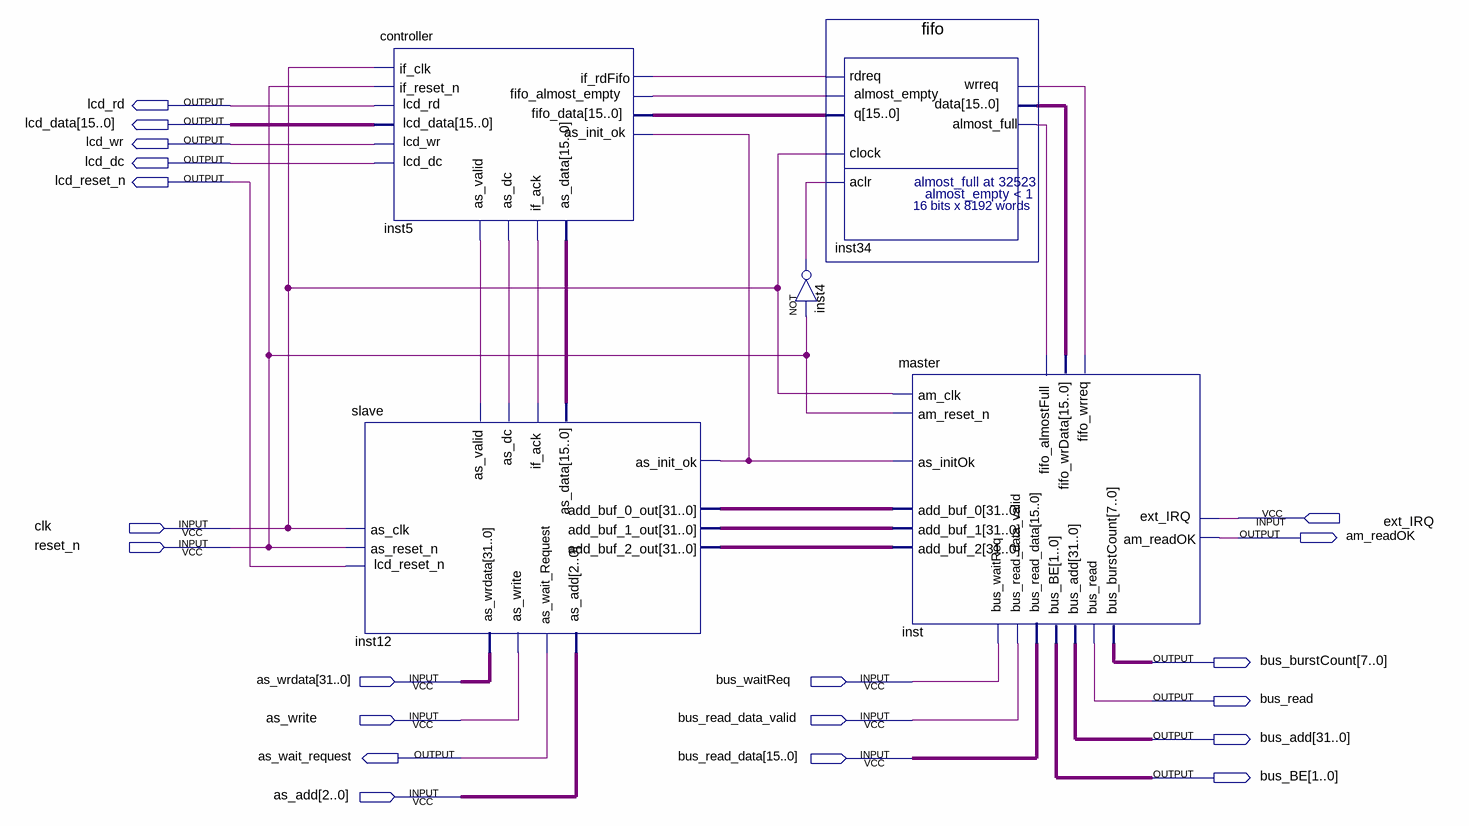
[diagram p0: schematic sheet]
// Quartus schematic LCD.bdf as structural Verilog: 5 symbols, 20 pins
module LCD (
  input  ext_IRQ,
  input  clk,
  input  reset_n,
  input  [31:0] as_wrdata,
  input  bus_waitReq,
  input  as_write,
  input  bus_read_data_valid,
  input  [15:0] bus_read_data,
  input  [2:0] as_add,
  output lcd_rd,
  output [15:0] lcd_data,
  output lcd_wr,
  output lcd_dc,
  output lcd_reset_n,
  output am_readOK,
  output [7:0] bus_burstCount,
  output bus_read,
  output [31:0] bus_add,
  output as_wait_request,
  output [1:0] bus_BE
);

  wire inst4_out, inst5_if_ack, inst5_if_rdfifo, inst12_as_dc, inst12_as_init_ok, inst12_as_valid,
       inst34_almost_empty, inst34_almost_full, inst_fifo_wrreq;
  wire [15:0] inst12_as_data, inst34_q, inst_fifo_wrdata;
  wire [31:0] inst12_add_buf_0_out, inst12_add_buf_1_out, inst12_add_buf_2_out;

  slave inst12 (
    .as_clk(clk), .as_reset_n(reset_n), .as_wrdata(as_wrdata), .as_add(as_add), .as_write(as_write),
    .if_ack(inst5_if_ack), .as_wait_Request(as_wait_request), .as_init_ok(inst12_as_init_ok),
    .add_buf_0_out(inst12_add_buf_0_out), .add_buf_1_out(inst12_add_buf_1_out),
    .add_buf_2_out(inst12_add_buf_2_out), .as_valid(inst12_as_valid), .as_data(inst12_as_data),
    .as_dc(inst12_as_dc), .lcd_reset_n(lcd_reset_n));
  controller inst5 (
    .if_clk(clk), .if_reset_n(reset_n), .as_init_ok(inst12_as_init_ok), .as_valid(inst12_as_valid),
    .as_data(inst12_as_data), .as_dc(inst12_as_dc), .fifo_almost_empty(inst34_almost_empty),
    .fifo_data(inst34_q), .if_ack(inst5_if_ack), .lcd_data(lcd_data), .lcd_dc(lcd_dc), .lcd_rd(lcd_rd),
    .lcd_wr(lcd_wr), .if_rdFifo(inst5_if_rdfifo));
  fifo inst34 (
    .data(inst_fifo_wrdata), .wrreq(inst_fifo_wrreq), .rdreq(inst5_if_rdfifo), .clock(clk), .aclr(inst4_out),
    .q(inst34_q), .almost_full(inst34_almost_full), .almost_empty(inst34_almost_empty));
  not inst4 (inst4_out, reset_n);
  master inst (
    .am_clk(clk), .am_reset_n(reset_n), .fifo_almostFull(inst34_almost_full), .as_initOk(inst12_as_init_ok),
    .add_buf_0(inst12_add_buf_0_out), .add_buf_1(inst12_add_buf_1_out), .add_buf_2(inst12_add_buf_2_out),
    .bus_waitReq(bus_waitReq), .bus_read_data_valid(bus_read_data_valid), .bus_read_data(bus_read_data),
    .ext_IRQ(ext_IRQ), .fifo_wrData(inst_fifo_wrdata), .fifo_wrreq(inst_fifo_wrreq), .bus_add(bus_add),
    .bus_read(bus_read), .bus_BE(bus_BE), .bus_burstCount(bus_burstCount), .am_readOK(am_readOK));
endmodule
